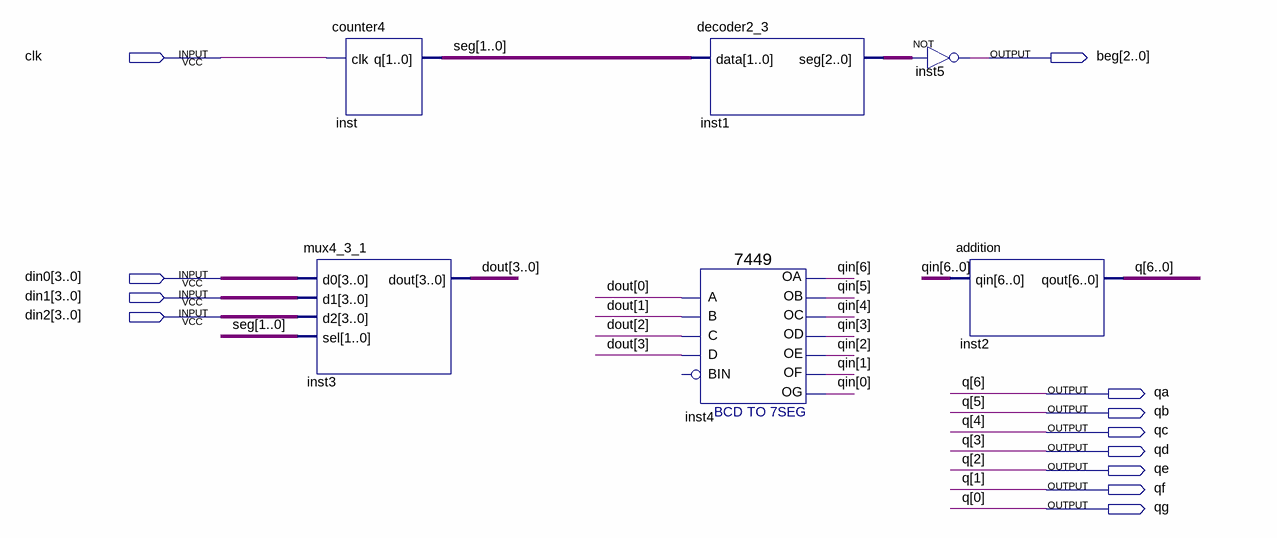
[diagram p0: schematic sheet]
// Quartus schematic scan_led3.bdf as structural Verilog: 6 symbols, 12 pins
module scan_led3 (
  input  clk,
  input  [3:0] din0,
  input  [3:0] din1,
  input  [3:0] din2,
  output [2:0] beg,
  output qa,
  output qb,
  output qc,
  output qd,
  output qe,
  output qf,
  output qg
);

  wire inst5_out;
  wire [1:0] seg;
  wire [2:0] inst1_seg;
  wire [3:0] dout;
  wire [6:0] qin;

  counter4 inst (.clk(clk), .q(seg));
  mux4_3_1 inst3 (.d0(din0), .d1(din1), .d2(din2), .sel(seg), .dout(dout));
  decoder2_3 inst1 (.data(seg), .seg(inst1_seg));
  \7449  inst4 (
    .A(dout[0]), .C(dout[2]), .B(dout[1]), .D(dout[3]), .OC(qin[4]), .OD(qin[3]), .OF(qin[1]), .OG(qin[0]),
    .OB(qin[5]), .OA(qin[6]), .OE(qin[2]));  // open: BIN
  assign inst5_out = ~inst1_seg;  // NOT inst5, 3 bits wide
  addition inst2 (.qin(qin), .qout({qa, qb, qc, qd, qe, qf, qg}));

  // Other names for the same wires on the sheet: q[6:0] = {qa, qb, qc, qd, qe, qf, qg}
endmodule
